# EAGLE design OTEStamper (EAGLE 9.6.2)
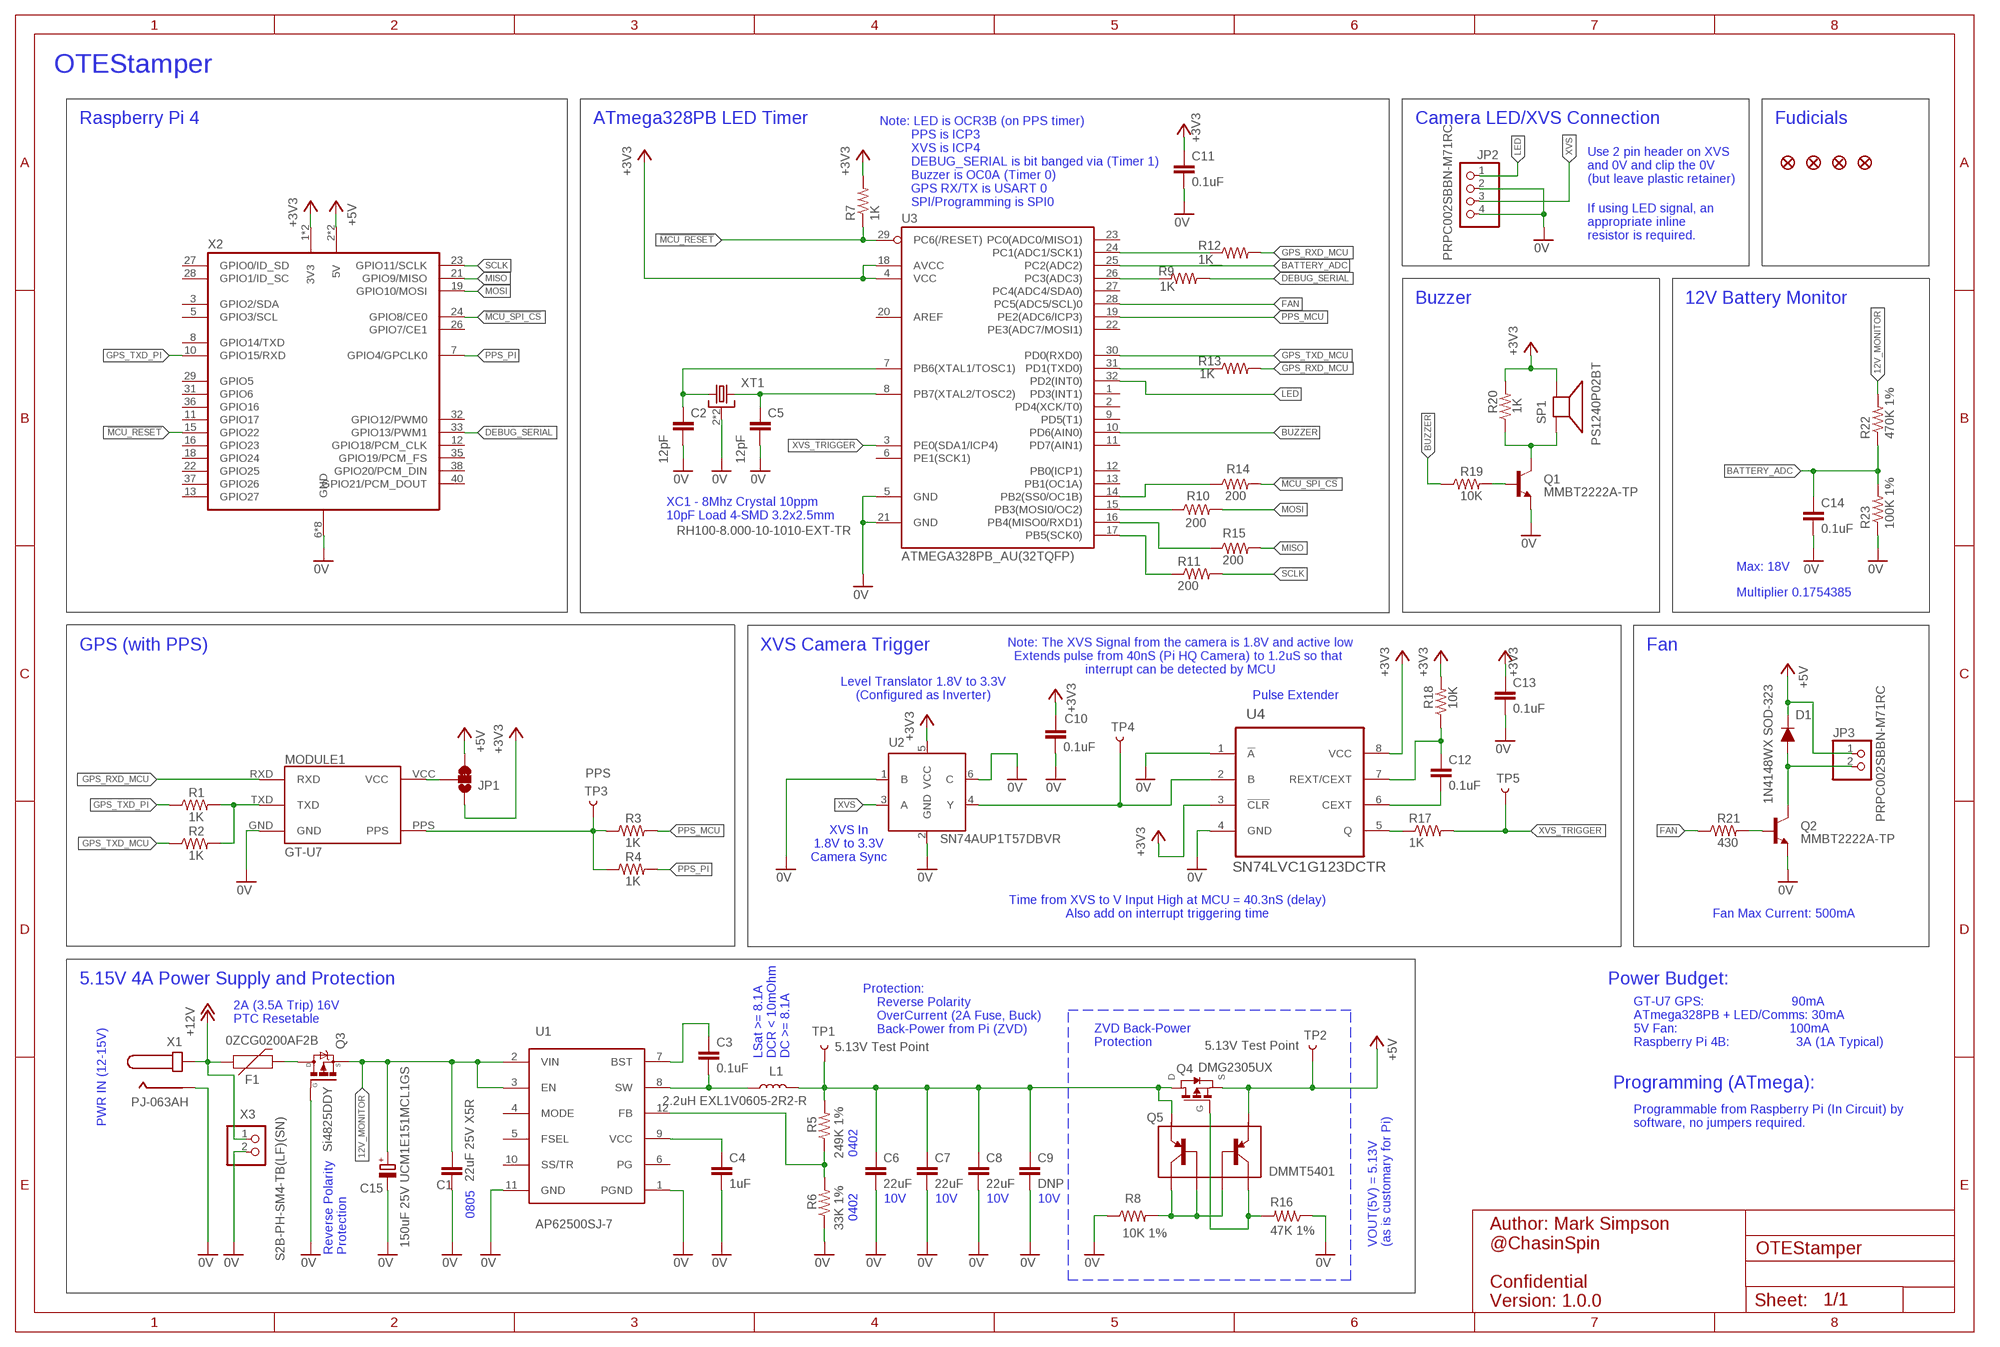
[diagram p0: schematic, sheet 1]

## Parts
C1  22uF 25V X5R  C-EUC0805K  [C0805K]
C2  12pF  C-EU  [C0603K]
C3  0.1uF  C-EUC0402K  [C0402K]
C4  1uF  C-EUC0402K  [C0402K]
C5  12pF  C-EU  [C0603K]
C6  22uF  C-EU  [C0603K]
C7  22uF  C-EU  [C0603K]
C8  22uF  C-EU  [C0603K]
C9  DNP  C-EU  [C0603K]
C10  0.1uF  C-EU  [C0603K]
C11  0.1uF  C-EU  [C0603K]
C12  0.1uF  C-EU  [C0603K]
C13  0.1uF  C-EU  [C0603K]
C14  0.1uF  C-EU  [C0603K]
C15  150uF 25V UCM1E151MCL1GS  CPOL-EUUD-6,3X7,7  [UD-6,3X7,7_NICHICON]
D1  1N4148WX SOD-323  DIODE  [SOD-323]
F1  0ZCG0200AF2B  FUSE-PTCF1812  [F1812]
FD1  FIDUCIALUFIDUCIAL  [FIDUCIAL-MICRO]
FD2  FIDUCIALUFIDUCIAL  [FIDUCIAL-MICRO]
FD3  FIDUCIALUFIDUCIAL  [FIDUCIAL-MICRO]
FD4  FIDUCIALUFIDUCIAL  [FIDUCIAL-MICRO]
JP1  JUMPER-SMT_3_1-NC_TRACE_SILK  [SMT-JUMPER_3_1-NC_TRACE_SILK]
JP2  PRPC002SBBN-M71RC  PINHD-1X4  [1X04]
JP3  PRPC002SBBN-M71RC  PINHD-1X2  [1X02]
L1  2.2uH EXL1V0605-2R2-R  EXL1V0605  [EXL1V0605]
MODULE1  GT-U7  [GT-U7]
Q1  MMBT2222A-TP  MMBT3904LT1G  [SOT23-BEC]
Q2  MMBT2222A-TP  MMBT3904LT1G  [SOT23-BEC]
Q3  Si4825DDY  SI4825DDY  [SOIC-8-BAR]
Q4  DMG2305UX  SI2323DDS  [SI2323DDS]
Q5  DMMT5401  [SOT26(SC74R)]
R1  1K  R-US  [R0603]
R2  1K  R-US  [R0603]
R3  1K  R-US  [R0603]
R4  1K  R-US  [R0603]
R5  249K 1%  R-USR0402  [R0402]
R6  33K 1%  R-USR0402  [R0402]
R7  1K  R-US  [R0603]
R8  10K 1%  R-US  [R0603]
R9  1K  R-US  [R0603]
R10  200  R-US  [R0603]
R11  200  R-US  [R0603]
R12  1K  R-US  [R0603]
R13  1K  R-US  [R0603]
R14  200  R-US  [R0603]
R15  200  R-US  [R0603]
R16  47K 1%  R-US  [R0603]
R17  1K  R-US  [R0603]
R18  10K  R-US  [R0603]
R19  10K  R-US  [R0603]
R20  1K  R-US  [R0603]
R21  430  R-US  [R0603]
R22  470K 1%  R-US  [R0603]
R23  100K 1%  R-US  [R0603]
SP1  PS1240P02BT  PS12/PS12  [PS12]
TP1  5.13V Test Point  TEST-POINT3  [PAD.03X.03]
TP2  5.13V Test Point  TEST-POINT3  [PAD.03X.03]
TP3  PPS  TEST-POINT3  [PAD.03X.03]
TP4  TEST-POINT3  [PAD.03X.03]
TP5  TEST-POINT3  [PAD.03X.03]
U1  AP62500SJ-7  AP62500  [AP62500]
U2  SN74AUP1T57DBVR  SN74AUP1T57  [SOT23-6-DBV]
U3  ATMEGA328PB_AU(32TQFP)  ATMEGA328PB_TQFP  [TQFP32-08]
U4  SN74LVC1G123DCTR  SN74LVC1G123DCT  [SSOP-8-DCT]
X1  PJ-063AH  [PJ-063AH]
X2  ADAFRUIT_2222  RASPBERRY_PI_HAT  [RASPBERRY_PI_HAT]
X3  S2B-PH-SM4-TB(LF)(SN)  [JST-PH-2-SMT-RA]
XT1  RH100-8.000-10-1010-EXT-TR  ECS-ECX-32  [ECS-ECX-32]

## Nets
0V: C1.2 C2.2 C4.2 C5.2 C6.2 C7.2 C8.2 C9.2 C10.2 C11.2 C13.2 C14.2 C15.- JP2.2 JP2.4 MODULE1.GND Q1.E Q2.E Q3.4(G) R6.1 R8.1 R16.1 R23.1 U1.1(PGND) U1.11(GND) U2.1(B) U2.2(GND) U2.6(C) U3.5(GND) U3.21(GND) U4.1(!A) U4.4(GND) X1.2(NEG) X1.SHIELD1(NEG) X1.SHIELD2(NEG) X2.6(GND) X2.9(GND) X2.14(GND) X2.20(GND) X2.25(GND) X2.30(GND) X2.34(GND) X2.39(GND) X3.2 XT1.2 XT1.4
12V_MONITOR: C1.1 C15.+ Q3.1(S) Q3.2(S) Q3.3(S) R22.2 U1.2(VIN) U1.3(EN)
!MCU_RESET: R7.1 U3.29(PC6(/RESET)) X2.15(GPIO22)
!MCU_SPI_CS: R14.2 X2.24(GPIO8/CE0)
+3V3: C10.1 C11.1 C13.1 JP1.1 R7.2 R18.2 R20.2 SP1.P$1(+) U2.5(VCC) U3.4(VCC) U3.18(AVCC) U4.3(!CLR) U4.8(VCC) X2.1(3V3) X2.17(3V3)
+5V: D1.CATHODE(K) JP1.3 JP3.1 Q4.2(S) Q5.5(E2) TP2.P$1 X2.2(5V) X2.4(5V)
+12V: F1.1 X1.1(POS) X3.1
BATTERY_ADC: C14.1 R22.1 R23.2 U3.25(PC2(ADC2))
BUCK_SW: C3.2 L1.1 U1.8(SW)
BUCK_VCC: C4.1 U1.9(VCC)
BUCK_VOUT: C6.1 C7.1 C8.1 C9.1 L1.2 Q4.3(D) Q5.6(E1) R5.2 TP1.P$1
BUZZER: R19.1 U3.10(PD6(AIN0))
DEBUG_SERIAL: R9.2 X2.33(GPIO13/PWM1)
FAN: R21.1 U3.28(PC5(ADC5/SCL)0)
FUSE_OUT: F1.2 Q3.5(D) Q3.6(D) Q3.7(D) Q3.8(D)
GPS_RXD_MCU: MODULE1.RXD R12.2 R13.2
GPS_TXD_MCU: R2.1 U3.30(PD0(RXD0))
GPS_TXD_PI: R1.1 X2.10(GPIO15/RXD)
LED: JP2.1 U3.32(PD2(INT0))
MCU_SPI_SELECT1: R14.1 U3.14(PB2(SS0/OC1B))
MISO: R15.2 X2.21(GPIO9/MISO)
MOSI: R10.2 X2.19(GPIO10/MOSI)
N$1: R9.1 U3.26(PC3(ADC3))
N$2: MODULE1.PPS R3.1 R4.1 TP3.P$1
N$3: D1.ANODE(A) JP3.2 Q2.C
N$4: Q2.B R21.2
N$6: C3.1 U1.7(BST)
N$8: R5.1 R6.2 U1.12(FB)
N$9: Q1.B R19.2
N$10: Q1.C R20.1 SP1.P$2(-)
N$11: MODULE1.TXD R1.2 R2.2
N$13: JP1.2 MODULE1.VCC
N$14: R17.1 U4.5(Q)
N$15: TP4.P$1 U2.4(Y) U4.2(B)
N$16: C12.2 U4.6(CEXT)
N$17: C12.1 R18.1 U4.7(REXT/CEXT)
N$20: C2.1 U3.7(PB6(XTAL1/TOSC1)) XT1.1
N$21: C5.1 U3.8(PB7(XTAL2/TOSC2)) XT1.3
N$22: R10.1 U3.15(PB3(MOSI0/OC2))
N$23: R15.1 U3.16(PB4(MISO0/RXD1))
N$24: R11.1 U3.17(PB5(SCK0))
N$25: R13.1 U3.31(PD1(TXD0))
N$27: R12.1 U3.24(PC1(ADC1/SCK1))
N$28: Q5.1(C1) Q5.2(B1) Q5.3(B2) R8.2
N$31: Q4.1(G) Q5.4(C2) R16.2
PPS_MCU: R3.2 U3.19(PE2(ADC6/ICP3))
PPS_PI: R4.2 X2.7(GPIO4/GPCLK0)
SCLK: R11.2 X2.23(GPIO11/SCLK)
XVS: JP2.3 U2.3(A)
XVS_TRIGGER: R17.2 TP5.P$1 U3.3(PE0(SDA1/ICP4))
Unconnected: U1.4(MODE) U1.5(FSEL) U1.6(PG) U1.10(SS/TR) U3.1(PD3(INT1)) U3.2(PD4(XCK/T0)) U3.6(PE1(SCK1)) U3.9(PD5(T1)) U3.11(PD7(AIN1)) U3.12(PB0(ICP1)) U3.13(PB1(OC1A)) U3.20(AREF) U3.22(PE3(ADC7/MOSI1)) U3.23(PC0(ADC0/MISO1)) U3.27(PC4(ADC4/SDA0)) X2.3(GPIO2/SDA) X2.5(GPIO3/SCL) X2.8(GPIO14/TXD) X2.11(GPIO17) X2.12(GPIO18/PCM_CLK) X2.13(GPIO27) X2.16(GPIO23) X2.18(GPIO24) X2.22(GPIO25) X2.26(GPIO7/CE1) X2.27(GPIO0/ID_SD) X2.28(GPIO1/ID_SC) X2.29(GPIO5) X2.31(GPIO6) X2.32(GPIO12/PWM0) X2.35(GPIO19/PCM_FS) X2.36(GPIO16) X2.37(GPIO26) X2.38(GPIO20/PCM_DIN) X2.40(GPIO21/PCM_DOUT)

## Notes on the sheet
- OTEStamper
- Raspberry Pi 4 | ATmega328PB LED Timer | Camera LED/XVS Connection | Fudicials
- Use 2 pin header on XVS
  and 0V and clip the 0V
  (but leave plastic retainer)
- Note: LED is OCR3B (on PPS timer)
           PPS is ICP3
           XVS is ICP4
           DEBUG_SERIAL is bit banged via (Timer 1)
           Buzzer is OC0A (Timer 0)
           GPS RX/TX is USART 0
           SPI/Programming is SPI0
- If using LED signal, an
  appropriate inline 
  resistor is required.
- Buzzer | 12V Battery Monitor
- XC1 - 8Mhz Crystal 10ppm 
  10pF Load 4-SMD 3.2x2.5mm
- Max: 18V
- Multiplier 0.1754385
- GPS (with PPS) | XVS Camera Trigger | Fan
- Note: The XVS Signal from the camera is 1.8V and active low
  Extends pulse from 40nS (Pi HQ Camera) to 1.2uS so that 
  interrupt can be detected by MCU
- Level Translator 1.8V to 3.3V
  (Configured as Inverter)
- Pulse Extender
- XVS In
  1.8V to 3.3V
  Camera Sync
- Time from XVS to V Input High at MCU = 40.3nS (delay)
  Also add on interrupt triggering time
- Fan Max Current: 500mA
- 5.15V 4A Power Supply and Protection | Power Budget:
- 2A (3.5A Trip) 16V
  PTC Resetable
- Protection:
      Reverse Polarity
      OverCurrent (2A Fuse, Buck)
      Back-Power from Pi (ZVD)
- ZVD Back-Power
  Protection
- GT-U7 GPS:                         90mA
  ATmega328PB + LED/Comms: 30mA
  5V Fan:                                100mA
  Raspberry Pi 4B:                   3A (1A Typical)
- LSat >= 8.1A
  DCR < 10mOhm
  DC >= 8.1A
- Programming (ATmega):
- PWR IN (12-15V)
- Programmable from Raspberry Pi (In Circuit) by
  software, no jumpers required.
- 0402
- 0805 | 10V | 10V | 10V | 10V
- 0402
- VOUT(5V) = 5.13V
  (as is customary for Pi)
- Reverse Polarity
  Protection
- Author: Mark Simpson
  @ChasinSpin
  
  Confidential
  Version: 1.0.0

## Library data of the parts
C1-C14 = SkyFall:C-EU: CAPACITOR, European symbol
C15 = rcl:CPOL-EU: POLARIZED CAPACITOR, European symbol; SPICEPREFIX: C
D1 = SkyFall:DIODE
F1 = SkyFall:FUSE-PTC: PTC Resetable Fuse PTC Resetable Fuse (Polyfuse)
FD1-FD4 = SkyFall:FIDUCIAL: Fiducial Alignment Points Point-of-reference for pick-and-place machines and other optical instruments.
JP1 = SkyFall:JUMPER-SMT_3_1-NC_TRACE: Normally closed trace jumper (1 of 2 connections) This jumper has a trace between two pads so it's normally closed (NC). The other connection is normally open (NO). Use a razor knife to open the connection. For best results follow the IPC guidelines for cutting traces: Cutout at least 0.063 mm (0.005 in). Remove all loose material to clean up the cut area. Seal the cut with an approved epoxy. Reapply solder to reclose the connection, or to close the NO connection.
JP2 = pinhead:PINHD-1X4: PIN HEADER
JP3 = pinhead:PINHD-1X2: PIN HEADER
L1 = SkyFall:EXL1V0605: Eaton EXL1V0605 High Current Molded Inductor Eaton EXL1V0605 High Current Molded Inductor(Datasheet)
MODULE1 = SkyFall:GT-U7: GT-U7 Goouuu Tech GT-U7 GPS Module (Datasheet)
Q1 Q2 = SkyFall:MMBT3904LT1G
Q3 = SkyFall:SI4825DDY: Si4825DDY P-Channel 30V (D-S) MOSFET Si4825DDY P-Channel 30V (D-S) MOSFET(Datasheet)
Q4 = SkyFall:SI2323DDS: SI2323DDS P-Channel MOSFET
Q5 = SkyFall:DMMT5401: DMMT5401 Dual PNP Small Signal Matched Transistors DMMT5401 Dual PNP Small Signal Matched Transistors(Datasheet)
R1-R23 = SkyFall:R-US: RESISTOR, US symbol
SP1 = SkyFall:PS12: SPEAKER Source: Buerklin Added PS12 (for part # PS1240 piezo) http://www.ladyada.net/library/pcb/eaglelibrary.html
TP1-TP5 = SkyFall:TEST-POINT: SparkFun Test Points Bare copper test points for troubleshooting or In-Circuit-Testing. These are used by our Production team for verifying production board runs using pogo-pins on test beds. SparkFun Products: SparkFun LSM9DS1 Breakout <https://www.sparkfun.com/products/13284> SparkFun PSOC <https://www.sparkfun.com/products/13714> SparkFun Load Cell Amplifier <https://www.sparkfun.com/products/13879>
U1 = SkyFall:AP62500: AP62500 4.5V to 18V Input, 5A Synchronous Buck Converter AP62500 4.5V to 18V Input, 5A Synchronous Buck ConverterDatasheet)
U2 = SkyFall:SN74AUP1T57: SN74AUP1T57 - Single-Supply Voltage-Level Translator SN74AUP1T57 - Single-Supply Voltage-Level Translator DBV Package (SOT23-6) (Datasheet)
U3 = SkyFall:ATMEGA328PB_TQFP: Popular 328P in QFP Storefront component: ATmega328 - TQFP (COM-13448) Datasheet SparkFun Products SparkFun RedBoard - Programmed with Arduino (DEV-12757) Arduino Pro Mini 328 - 5V/16MHz (DEV-11113) Arduino Pro Mini 328 - 3.3V/8MHz (DEV-11114) SparkFun OpenLog (DEV-13712) SparkFun MicroView - OLED Arduino Module (DEV-12923) SparkFun Digital Sandbox (DEV-12651) SparkFun PicoBoard (WIG-11888) Arduino Fio (DEV-10116) LilyPad Arduino 328 Main Board (DEV-13342) SparkFun RedStick (DEV-13741) LilyPad MP3 (DEV-11013) LilyPad Arduino SimpleSnap (DEV-10941) SparkFun Stepoko (ROB-13899) SparkFun Geiger Counter (SEN-11345) SparkFun EL Sequencer (COM-12781) Arduino Pro 328 - 5V/16MHz (DEV-10915) CryptoCape (DEV-12773) SparkFun IR Thermometer Evaluation Board - MLX90614 (SEN-10740) SparkFun RedBot Mainboard (ROB-12097) Arduino Pro 328 - 3.3V/8MHz (DEV-10914) SparkFun Block for Intel® Edison - Arduino (DEV-13036) SparkFun Simon Says - Surface Mount Soldering Kit (KIT-10935) SparkFun 7-Segment Serial Display - Red (COM-11441) SparkFun 7-Segment Serial Display - White (COM-11629) SparkFun 7-Segment Serial Display - Yellow (COM-11443) SparkFun 7-Segment Serial Display - Kelly Green (COM-11440) SparkFun 7-Segment Serial Display - Blue (COM-11442) SparkFun OpenSegment Serial Display - 20mm (Blue) (COM-11647) SparkFun OpenSegment Serial Display - 20mm (Green) (COM-11646) SparkFun OpenSegment Serial Display - 20mm (White) (COM-11648) SparkFun OpenSegment Serial Display - 20mm (Red) (COM-11644) SparkFun OpenSegment Serial Display - 20mm (Yellow) (COM-11645) SparkFun OpenSegment Shield (DEV-13190); PROD_ID: IC-09069
U4 = SkyFall:SN74LVC1G123DCT: Single Retriggerable Monostable Multivibrator WIth Schmitt-Trigger Inputs Single Retriggerable Monostable Multivibrator WIth Schmitt-Trigger Inputs (Datasheet)
X1 = SkyFall:PJ-063AH: PJ-063AH 8A DC 2.1x5.5mm Power Jack PJ-063AH 8A DC 2.1x5.5mm Power Jack(Datasheet)
X2 = SkyFall:RASPBERRY_PI_HAT: Raspberry Pi 4 Hat Raspberry Pi 4 Hat + Adafruit 2222 (Datasheet)
X3 = SkyFall:S2B-PH-SM4-TB(LF)(SN): S2B-PH-SM4-TB(LF)(SN) JST-PH Right Angled 2Pos 2mm LiPo S2B-PH-SM4-TB(LF)(SN) JST-PH Right Angled 2Pos 2mm LiPo (Datasheet)
XT1 = clarion:ECS-ECX-32: ECS 3.2 x 2.5 x 0.8mm SMD Crystal ECS ECX-32 Series SMD Crystal (Datasheet)

## Board
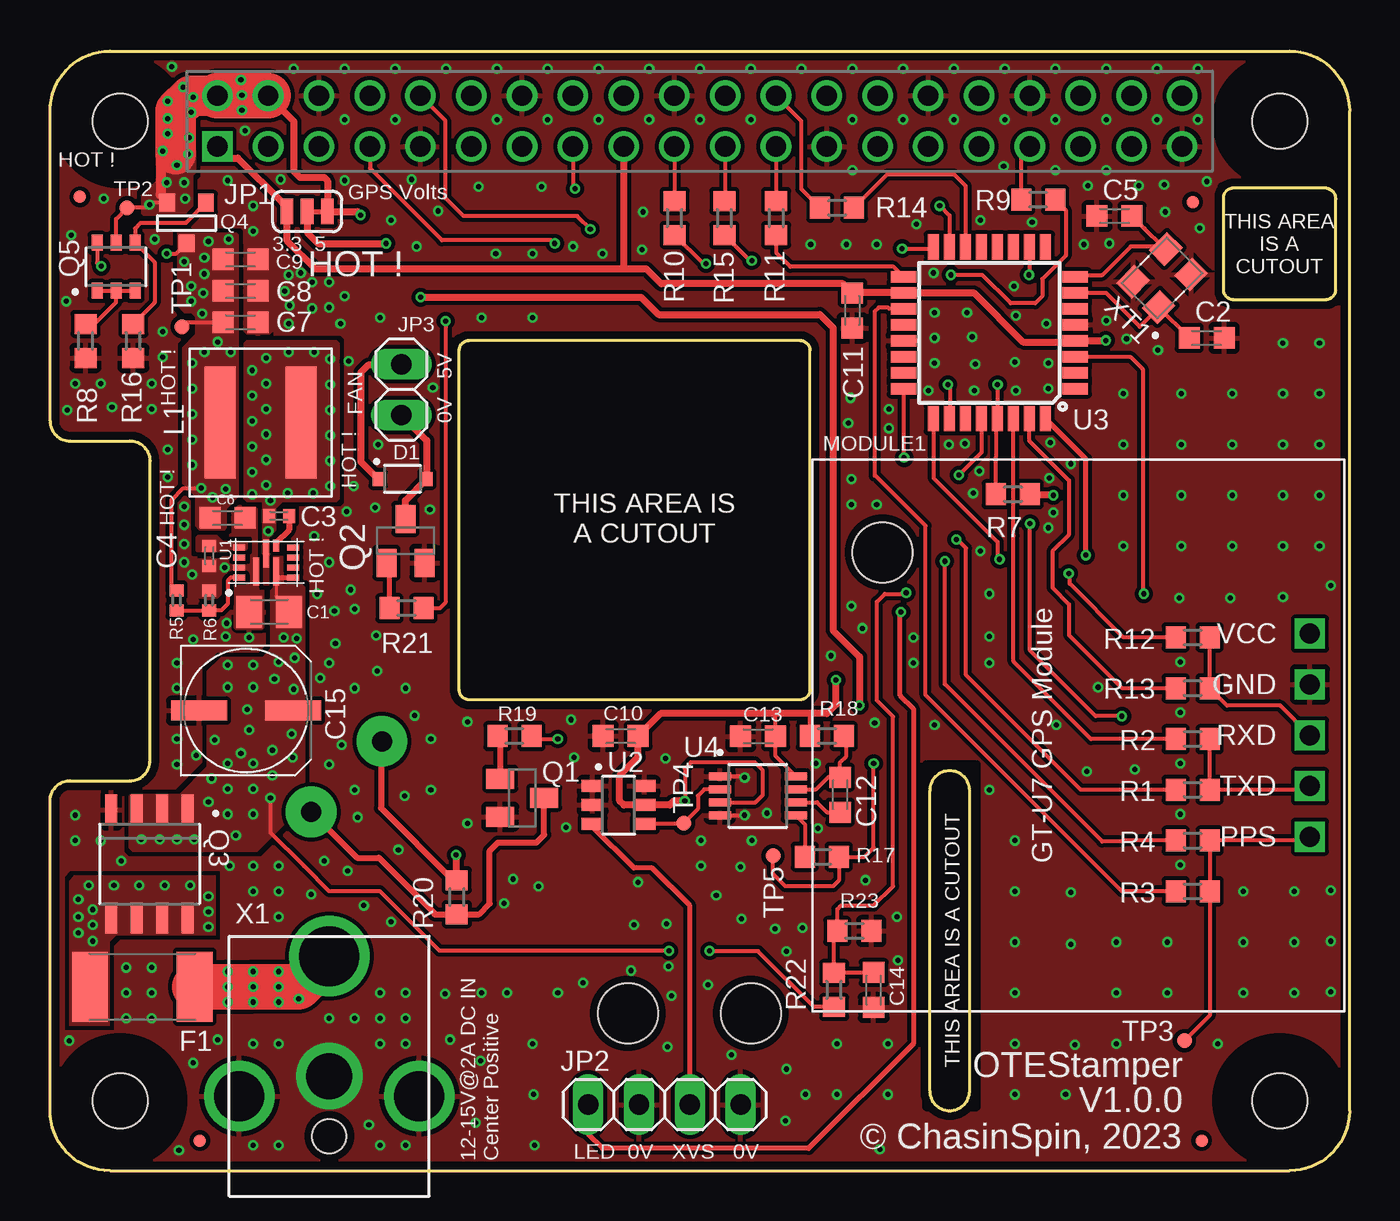
[diagram p1: board, top side]
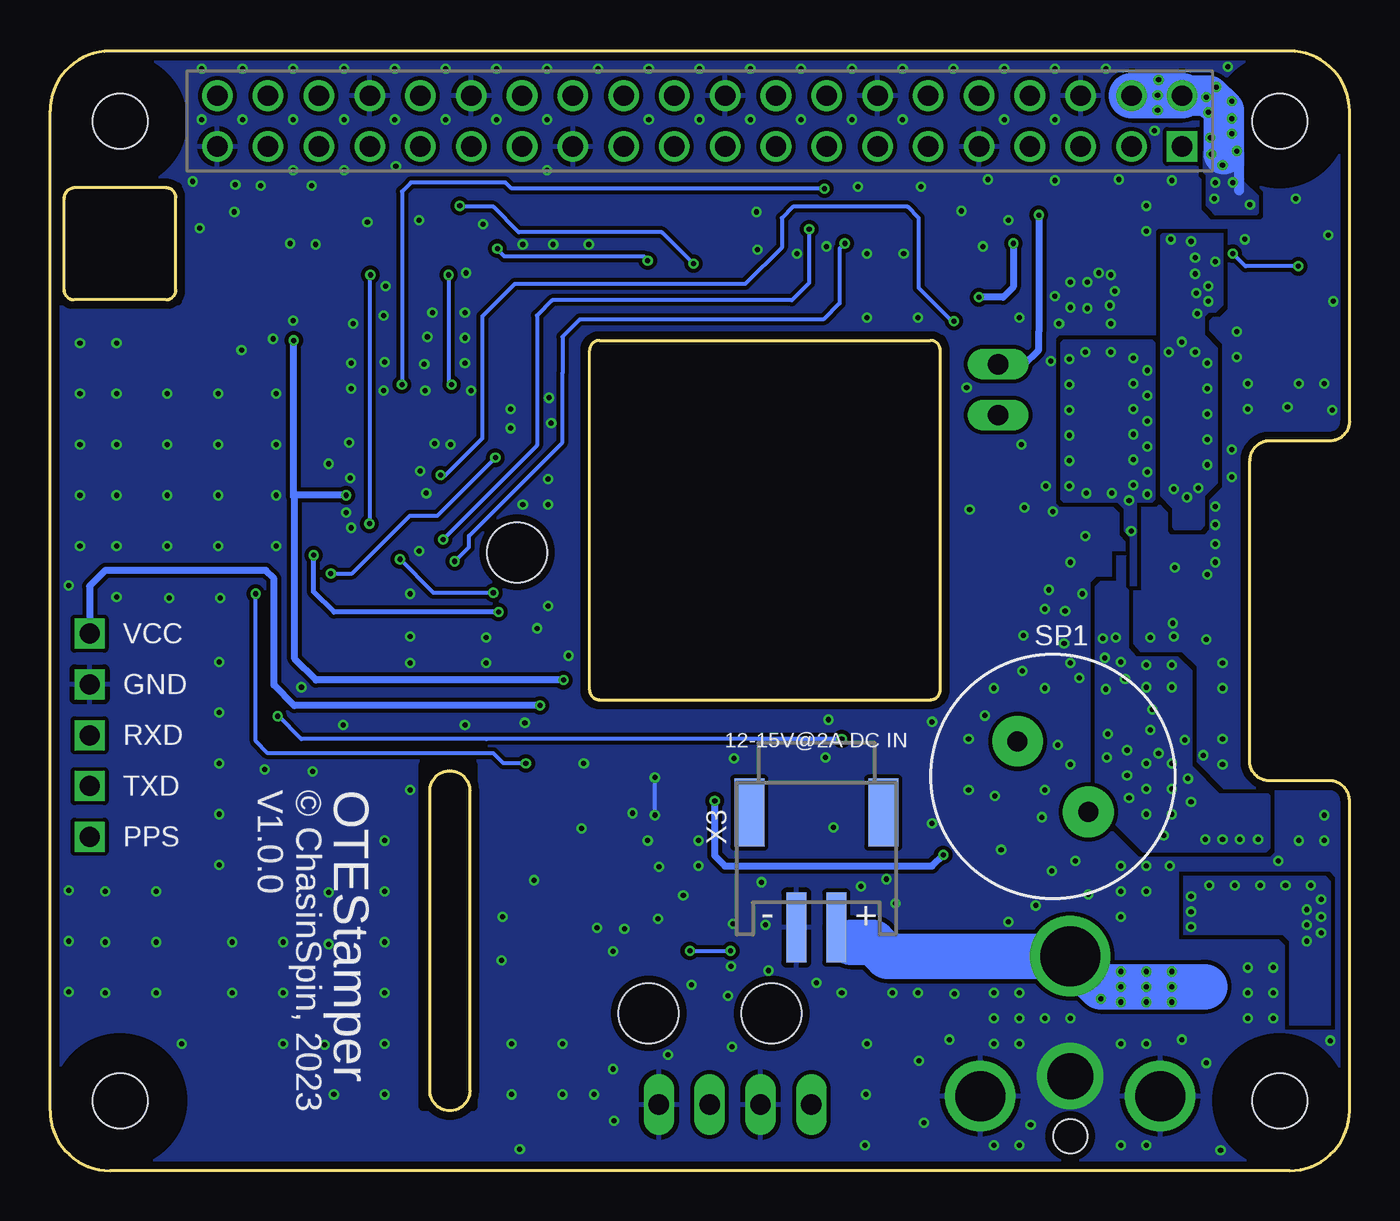
[diagram p2: board, bottom side, seen from below]

Size 65 x 56 mm. Coordinates in mm from the lower left corner, seen from the top.
Outline: 20.47,24.05 20.47,41.03 arc-90 20.97,41.53 37.51,41.53 arc-90 38.01,41.03 38.01,24.05 arc-90 37.51,23.55 20.97,23.55 arc-90 20.47,24.05
Copper layers (1*16): Top 0.035559375mm / dielectric 1.6mm / Bottom 0.035559375mm
Design rules "oshpark-2layer *": minimum track width 6mil, minimum drill 10mil, track to track 6mil, track to pad 6mil, pad to pad 6mil, via to via 6mil, smd to smd 6mil, copper to edge 15mil, drill to drill 6mil, minimum pad ring 5mil, minimum via ring 5mil, stop-mask expansion 2.5mil, vias tented up to drill 20mil, thermal gap 10mil
Holes 3 mm at 28.91,7.87 35.05,7.87
tRestrict: area 20.4,23.5 to 38,41.6; area 58.6,43.5 to 64.4,49.2; area 43.8,3.2 to 46.4,20.3
bRestrict: area 20.4,23.5 to 38,41.6; area 58.6,43.5 to 64.4,49.2; area 43.8,3.2 to 46.4,20.3

### Footprints (pad centres in the part's own frame; a part is rotated, then mirrored left to right if it is on the bottom)
C0805K = smd 1.3 x 1.6: 1 -1,0; 2 1,0
C0603K = smd 1.05 x 1.08: 1 -0.875,0; 2 0.875,0
C0402K = smd 0.6 x 0.7: 1 -0.5,0; 2 0.5,0
UD-6,3X7,7_NICHICON = smd 2.8 x 1: + 2.35,0; - -2.35,0
SOD-323 = smd 0.56 x 0.69: ANODE -1.22,0; CATHODE 1.22,0
F1812 = smd 1.78 x 3.5: 1 -2.615,0; 2 2.615,0
FIDUCIAL-MICRO = smd 0.635 x 0.635: 1 0,0
SMT-JUMPER_3_1-NC_TRACE_SILK = smd 0.635 x 1.27: 1 -1.016,0; 2 0,0; 3 1.016,0
1X04 = drill 1.016 long: 1 -3.81,0; 2 -1.27,0; 3 1.27,0; 4 3.81,0
1X02 = drill 1.016 long: 1 -1.27,0; 2 1.27,0
EXL1V0605 = smd 1.55 x 5.6: 1 -2.025,0; 2 2.025,0
GT-U7 = drill 1 square: GND -2.54,11.58; PPS 5.08,11.58; RXD 0,11.58; TXD 2.54,11.58; VCC -5.08,11.58 | hole 3: -9.15,-9.8
SOT23-BEC = smd 1 x 1.4: B -0.95,-1.1; C 0,1.1; E 0.95,-1.1
SOIC-8-BAR = smd 1.55 x 0.6: 1 -2.7,1.905; 2 -2.7,0.635; 3 -2.7,-0.635; 4 -2.7,-1.905; 5 2.7,-1.905; 6 2.7,-0.635; 7 2.7,0.635; 8 2.7,1.905
SI2323DDS = smd 0.787 x 0.889: 1 0.991,1.016; 2 -0.94,1.016; 3 0.025,-1.016
SOT26(SC74R) = smd 0.8 x 0.55: 1 -1.2,0.95; 2 -1.2,0; 3 -1.2,-0.95; 4 1.2,-0.95; 5 1.2,0; 6 1.2,0.95
R0603 = smd 1 x 1.1: 1 -0.85,0; 2 0.85,0
R0402 = smd 0.6 x 0.7: 1 -0.5,0; 2 0.5,0
PS12 = drill 1 pad 2.54: P$1 -2.5,0; P$2 2.5,0
PAD.03X.03 = smd 0.762 x 0.762: P$1 0,0
AP62500 = smd 1.4 x 0.3: 1 -0.45,0.5; 2 -0.45,-0.5; 8 0.45,0 | smd 0.3 x 0.6: 3 -0.75,-1.35; 4 -0.25,-1.35; 5 0.25,-1.35; 6 0.75,-1.35; 9 0.75,1.35; 10 0.25,1.35; 11 -0.25,1.35; 12 -0.75,1.35 | smd 0.6 x 0.3: 7 0.85,-0.5
SOT23-6-DBV = smd 1.1 x 0.6: 1 -1.3,0.95; 2 -1.3,0; 3 -1.3,-0.95; 4 1.3,-0.95; 5 1.3,0; 6 1.3,0.95
TQFP32-08 = smd 1.27 x 0.559: 1 -4.293,2.8; 2 -4.293,2; 3 -4.293,1.2; 4 -4.293,0.4; 5 -4.293,-0.4; 6 -4.293,-1.2; 7 -4.293,-2; 8 -4.293,-2.8; 17 4.293,-2.8; 18 4.293,-2; 19 4.293,-1.2; 20 4.293,-0.4; 21 4.293,0.4; 22 4.293,1.2; 23 4.293,2; 24 4.293,2.8 | smd 0.559 x 1.27: 9 -2.8,-4.293; 10 -2,-4.293; 11 -1.2,-4.293; 12 -0.4,-4.293; 13 0.4,-4.293; 14 1.2,-4.293; 15 2,-4.293; 16 2.8,-4.293; 25 2.8,4.293; 26 2,4.293; 27 1.2,4.293; 28 0.4,4.293; 29 -0.4,4.293; 30 -1.2,4.293; 31 -2,4.293; 32 -2.8,4.293
SSOP-8-DCT = smd 1.1 x 0.4: 1 -1.9,0.975; 2 -1.9,0.325; 3 -1.9,-0.325; 4 -1.9,-0.975; 5 1.9,-0.975; 6 1.9,-0.325; 7 1.9,0.325; 8 1.9,0.975
PJ-063AH = drill 3: 1 0,12 | drill 2.3: 2 0,6 | drill 2.5: SHIELD1 -4.5,5; SHIELD2 4.5,5 | hole 1.7: 0,3
RASPBERRY_PI_HAT = drill 1.02 square: 1 8.37,51.23 | drill 1.02: 2 8.37,53.77; 3 10.91,51.23; 4 10.91,53.77; 5 13.45,51.23; 6 13.45,53.77; 7 15.99,51.23; 8 15.99,53.77; 9 18.53,51.23; 10 18.53,53.77; 11 21.07,51.23; 12 21.07,53.77; 13 23.61,51.23; 14 23.61,53.77; 15 26.15,51.23; 16 26.15,53.77; 17 28.69,51.23; 18 28.69,53.77; 19 31.23,51.23; 20 31.23,53.77; 21 33.77,51.23; 22 33.77,53.77; 23 36.31,51.23; 24 36.31,53.77; 25 38.85,51.23; 26 38.85,53.77; 27 41.39,51.23; 28 41.39,53.77; 29 43.93,51.23; 30 43.93,53.77; 31 46.47,51.23; 32 46.47,53.77; 33 49.01,51.23; 34 49.01,53.77; 35 51.55,51.23; 36 51.55,53.77; 37 54.09,51.23; 38 54.09,53.77; 39 56.63,51.23; 40 56.63,53.77 | hole 2.75: 3.5,3.5; 61.5,3.5; 61.5,52.5; 3.5,52.5
JST-PH-2-SMT-RA = smd 1 x 3.5: 1 1,-4.35; 2 -1,-4.35 | smd 1.5 x 3.4: NC1 -3.35,1.4; NC2 3.35,1.4
ECS-ECX-32 = smd 1.3 x 1.1: 1 -1.15,-0.9; 2 1.15,-0.9; 3 1.15,0.9; 4 -1.15,0.9

### Placement (x,y rotation side)
C1  10.97,27.95 180 top
C2  57.86,41.66 0 top
C3  11.46,32.75 180 top
C4  7.96,30.75 270 top
C5  53.24,47.75 180 top
C6  8.89,32.65 0 top
C7  9.53,42.43 0 top
C8  9.53,44.01 0 top
C9  9.53,45.58 0 top
C10  28.55,21.74 180 top
C11  40.13,43.03 270 top
C12  39.52,18.8 270 top
C13  35.42,21.73 180 top
C14  41.2,9.04 270 top
C15  9.8,23.01 0 top
D1  17.63,34.59 180 top
F1  4.62,9.19 180 top
FD1  57.16,48.44 0 top
FD2  57.61,1.5 0 top
FD3  1.49,48.71 0 top
FD4  7.49,1.5 0 top
JP1  12.87,47.98 0 top
JP2  30.73,3.3 0 top
JP3  17.58,39.07 270 top
L1  10.53,37.41 180 top
MODULE1  51.44,21.78 270 top
Q1  23.62,18.64 270 top
Q2  17.78,31.5 0 top
Q3  4.98,15.34 270 top
Q4  6.81,47.4 0 top
Q5  3.3,45.21 90 top
R1  57.15,19.05 0 top
R2  57.15,21.59 0 top
R3  57.15,13.97 180 top
R4  57.15,16.51 180 top
R5  6.33,28.52 90 top
R6  7.96,28.52 270 top
R7  48.16,33.83 0 top
R8  1.78,41.5 90 top
R9  49.43,48.56 180 top
R10  31.24,47.65 90 top
R11  36.32,47.65 90 top
R12  57.15,26.67 0 top
R13  57.15,24.13 0 top
R14  39.37,48.16 180 top
R15  33.73,47.65 90 top
R16  4.17,41.5 90 top
R17  38.61,15.7 0 top
R18  38.86,21.74 180 top
R19  23.23,21.74 180 top
R20  20.35,13.68 90 top
R21  17.83,28.14 180 top
R22  39.22,9.04 270 top
R23  40.23,11.99 180 top
SP1  14.83,19.71 315 bottom
TP1  6.6,42.21 90 top
TP2  3.86,48.16 0 top
TP3  56.74,6.5 0 top
TP4  31.7,17.37 0 top
TP5  36.17,15.75 0 top
U1  10.82,30.43 90 top
U2  28.45,18.29 0 top
U3  46.99,41.91 180 top
U4  35.41,18.75 0 top
X1  13.97,-1.27 0 top
X2  0,0 0 top
X3  26.67,16.51 0 bottom
XT1  55.63,44.65 45 top

### Tracks (layer width: path | path; a pad name or v marks a point on that pad's centre or on a via)
0V  (via drill 0.25)
  Top 0.152: 34.69,17.77 34.7,17.78 v34.75,17.78 | U4.1
  Top 0.203: U4.4 34.69,17.77 | v34.75,19.66 34.7,19.71 U4.1
  Bottom 0.203: v34.75,17.78 v34.75,19.66
  other vias: 8.84,27.38 8.74,30.18 7.11,29.82 6.71,30.43 6.71,31.34 6.71,32.31 6.71,33.22 9.96,26.67 8.79,26.72 11.94,42.37 11.99,43.28 11.73,43.99 11.94,44.81 5.23,46.58 14.88,14.99 11.43,13.97 10.16,13.97 11.43,12.7 15.7,13.26 17.07,12.45 16.51,8.89 17.78,8.89 17.78,6.35 17.78,7.62 16.51,7.62 16.51,6.35 15.24,7.62 13.97,7.62 16.51,1.27 11.43,1.27 11.43,6.35 10.16,6.35 5.08,8.89 5.08,10.16 5.08,7.62 3.81,7.62 3.81,10.16 3.81,8.89 0.97,6.5 2.54,16.51 1.27,16.51 1.27,17.78 6.35,20.32 6.35,21.59 17.73,18.75 6.35,24.13 6.35,25.4 7.16,26.57 10.16,15.24 3.56,15.49 8.99,15.24 14.58,21.29 18.24,22.76 19.05,21.59 13.97,25.4 14.27,26.37 14.22,27.99 13.36,28.85 15.24,28.09 13.21,31.75 14.83,32.97 15.19,34.24 16.41,36.32 15.04,29.06 13.97,30.43 14.94,40.49 14.53,42.37 13.97,43.18 13.97,44.45 13.11,43.13 13.11,44.45 12.55,44.91 10.16,46.99 8.89,49.53 10.16,48.26 2.54,39.37 1.27,39.37 0.86,38.05 3.1,38.2 5.08,39.37 5.08,38.1 5.64,40.69 5.64,41.96 1.07,46.79 2.69,48.62 0.81,43.48 5.89,36.07 5.89,34.7 7.16,5.38 8.38,6.55 10.16,1.27 6.45,1.02 17.78,1.27 15.95,2.29 13.06,13.82 11.43,15.24 48.26,13.97 43.18,26.67 43.18,25.4 44.25,22.3 46.18,33.88 44.96,36.32 45.77,36.37 46.48,35 49.99,34.65 50.04,36.42 51.05,35.36 50.19,32.92 49.94,32.16 46.99,28.85 46.99,26.72 46.99,25.4 50.34,22.3 51.87,19.96 54.25,20.07 52.43,24.18 46.53,30.99 40.08,34.59 41.35,33.32 40.08,33.32 40.08,28.24 40.64,27.13 39.07,25.76 41.25,22.4 56.54,25.45 56.54,22.91 56.54,20.37 56.54,17.83 56.54,15.29 56.49,28.65 59.03,28.65 61.67,28.7 56.59,31.24 56.59,33.78 56.59,36.32 56.59,38.86 59.13,38.86 59.13,36.32 59.13,33.78 59.13,31.24 61.67,31.24 61.67,33.78 61.67,36.32 61.67,38.86 63.5,38.86 63.5,36.32 63.5,33.78 63.5,31.24 64.06,29.26 64.06,14.02 53.7,31.24 53.7,33.78 53.7,36.32 53.7,38.86 61.67,41.4 63.5,41.4 57.51,47.14 55.73,49.33 55.78,47.96 57.86,49.48 51.71,46.33 52.98,46.38 52.83,42.52 53.85,41.61 55.42,41.05 51.92,49.28 54.46,49.28 46.53,47.55 49.12,47.45 47.7,50.24 44.2,44.91 44.25,42.93 44.25,41.66 44.25,40.39 43.94,39.01 46.23,39.01 48.31,39.01 49.94,39.12 49.94,40.39 49.83,42.37 48.31,42.77 45.87,42.93 46.13,41.71 46.28,40.34 48.26,40.44 48.21,44.25 41.96,38.1 41.96,37.13 39.93,37.39 40.03,38.66 41.35,46.33 39.83,46.33 38.05,46.33 43.33,47.35 38.3,20.37 38.4,17.12 35.86,17.88 30.78,20.62 48.26,16.51 46.99,19.05 48.26,11.43 51.05,11.33 51.05,13.92 53.34,11.43 55.88,11.43 55.88,8.89 53.34,8.89 48.26,8.89 59.69,8.89 62.23,8.89 62.23,11.43 62.23,13.97 59.69,13.97 59.69,11.43 64.06,11.48 64.06,8.94 48.26,6.35 51.26,6.3 53.34,6.35 58.42,6.35 50.8,3.81 48.26,3.81 41.91,3.81 41.91,6.35 39.37,6.35 39.37,3.81 36.83,5.08 37.8,3.81 34.09,5.79 36.78,2.49 42.37,12.7 42.42,10.52 21.54,5.49 21.29,2.39 20.02,6.55 22.86,8.89 21.59,8.89 22.71,13.36 25.4,8.89 23.16,14.58 24.43,14.22 26.67,9.4 29.06,10.01 29.21,12.29 30.84,12.34 30.94,10.21 36.83,10.97 36.27,12.09 37.64,12.14 40.79,14.53 35.1,16.51 32.56,16.51 32.56,15.24 34.54,15.19 26.06,22.56 26.21,20.68 25.81,17.17 20.88,22.45 20.88,17.37 19.05,19.05 15.24,19.05 15.39,17.68 13.97,20.32 15.24,24.13 17.78,24.13 17.42,16.05 13.51,24.64 13.72,15.49 16.26,33.17 19.15,39.17 19,33.07 21.59,42.67 24.13,42.67 22.3,45.87 24.13,45.87 26.16,46.23 27.64,45.87 29.62,46.08 29.67,47.96 24.59,49.23 21.44,49.23 19.41,48.01 18.34,46.23 17.07,47.55 14.73,49.53 14.73,43.74 11.53,49.58 14.73,52.58 17.27,52.58 22.35,52.58 24.89,52.58 27.43,52.58 29.97,52.58 32.51,52.58 35.05,52.58 40.13,52.58 42.67,52.58 45.21,52.58 47.75,52.58 50.29,52.58 52.83,52.58 55.37,52.58 57.4,52.58 55.37,55.12 57.4,55.12 52.83,55.12 50.29,55.12 47.75,55.12 45.21,55.12 42.67,55.12 40.13,55.12 37.59,55.12 35.05,55.12 32.51,55.12 29.97,55.12 27.43,55.12 24.89,55.12 22.35,55.12 19.81,55.12 17.27,55.12 14.73,55.12 12.19,55.12 6.1,55.22 9.75,52.02 18.08,49.58 40.13,50.04 50.29,50.04 52.83,50.04 16.36,24.99 16.31,26.77 7.32,20.78 16.51,42.67 29.41,14.43 33.32,13.77 34.59,12.6 24.13,6.35 24.18,3.81 24.23,1.27 30.89,6.2 31.09,8.74 32.92,9.3 41.5,1.07 19.76,8.84
  pour Top (isolate 0.203, rank 2): 0,0 0,56 65,56 65,0
  pour Bottom (isolate 0.203, rank 2): 0,0 0,56 65,56 65,0
  pour Top (isolate 0.203, rank 2, no thermals): 10.72,27.18 10.72,29.01 10.46,29.26 10.46,33.02 10.21,33.27 9.35,33.27 9.09,33.02 9.09,31.85 9.25,31.7 9.82,31.7 10.01,31.5 10.01,30.38 9.96,30.33 9.04,30.33 8.79,30.58 7.11,30.58 7.11,28.65 8.38,28.65 8.59,28.85 8.59,29.67 8.94,30.02 9.96,30.02 10.01,29.97 10.01,29.36 9.91,29.26 9.3,29.26 9.19,29.16 9.19,27.18 9.3,27.08 10.62,27.08
  pour Top (isolate 0.203, rank 2, no thermals): 9.7,41.96 9.7,46.38 9.8,46.48 11.02,46.48 11.18,46.33 11.18,42.01 10.97,41.81 9.86,41.81
  pour Top (isolate 0.203, no thermals): 11.68,6.86 11.68,2.79 16.26,2.79 16.26,6.86
  pour Bottom (isolate 0.203, no thermals): 11.68,6.86 11.68,2.79 16.26,2.79 16.26,6.86
12V_MONITOR  (via drill 0.25)
  Top 0.152: 11.32,29.68 U1.2 11.32,28.79 11.39,28.53 C1.1
  Top 0.203: v11.02,18.64 11.02,16.92 12.7,15.24 13.97,13.97 16.51,13.97 19.48,11 v30.96,11 | R22.2 38.2,8.19 35.42,10.97 33.12,10.97 33.07,10.92 v32.99,11
  Top 0.254: 11.32,29.68 U1.3
  Bottom 0.203: v32.99,11 31.01,11 30.99,10.97 v30.96,11
  other vias: 11.68,26.67 8.08,19.61 4.57,16.56 5.49,16.56 6.35,16.56 7.21,16.56 9.3,16.76 7.92,18.44 8.89,17.83 10.16,17.83 10.16,19.1 8.89,19.1 8.89,20.37 10.16,20.37 12.14,20.68 10.16,24.18 8.89,24.18 9.55,20.88 11.43,25.45 12.34,26.62 12.24,25.65 8.89,25.3 10.16,25.3 12.19,24.08 11.13,21.03 11.13,19.76 11.23,24.59 12.09,21.84 9.96,22.05 9.86,23.06 8.23,21.54
  pour Top (isolate 0.203, no thermals): 11.04,26.25 11.04,29.02 11.18,29.16 11.18,30.76 11.19,30.75 11.66,30.75 11.66,29.47 11.82,29.31 12.62,29.31 12.73,29.2 12.73,26.25 12.57,26.09 11.2,26.09
  pour Bottom (isolate 0.203, no thermals): 11.04,26.25 11.04,29.02 11.18,29.16 11.18,30.76 11.19,30.75 11.66,30.75 11.66,29.47 12.46,29.47 12.73,29.2 12.73,26.25 12.57,26.09 11.2,26.09
  pour Top (isolate 0.203, no thermals): 6.5,18.85 7.87,20.22 7.87,24.99 8.59,25.7 10.67,25.7 11.04,26.11 11.04,27.43 12.73,27.43 12.73,18.34 10.33,15.95 4.17,15.95 3.96,16.15 3.96,18.75 4.06,18.85
  pour Bottom (isolate 0.203, no thermals): 6.5,18.85 7.87,20.22 7.87,24.99 8.59,25.7 10.67,25.7 11.04,26.11 11.04,27.43 12.73,27.43 12.73,18.34 10.33,15.95 4.17,15.95 3.96,16.15 3.96,18.75 4.06,18.85
!MCU_RESET  (via drill 0.25)
  Top 0.203: X2.15 26.15,49.24 v26.26,49.12 | v47.4,39.32 U3.29 47.35,37.57 R7.1
  Bottom 0.203: v26.26,49.12 41.91,49.12 42.22,49.43 46.94,49.43 47.4,48.97 v47.4,39.32
!MCU_SPI_CS
  Top 0.203: X2.24 37.57,52.51 37.57,49.11 R14.2
+3V3  (via drill 0.25)
  Top 0.203: U4.3 35.29,18.42 35.66,18.8 35.66,20.02 35.26,20.42 32.05,20.42 31.75,20.12 v31.75,18.49 | 36.32,22.86 36.3,22.83 C13.1 36.3,20.73 U4.8 | R18.2 38.01,22.77 38.1,22.86
  Top 0.305: C11.1 | 51.23,41.45 U3.4 | SP1.P$1 16.56,21.44 16.56,18.14 20.17,14.53 R20.2
  Top 0.356: C11.1 U3.18 46.21,43.91 48.67,41.45 51.23,41.45 | X2.1 8.95,50.65 9.4,50.65 11.61,48.44 11.85,48.2 JP1.1 11.85,46.52 13.26,45.11 28.75,45.11 | 28.75,45.11 29.82,45.11 30.57,44.36 39.67,44.36 C11.1 | X2.17 28.69,45.17 28.75,45.11 | U3.4 52.77,41.51 52.78,41.5 v52.81,41.53 | v50.19,33.78 49.06,33.78 R7.2 | R20.2 20.34,15.67 20.37,15.7 20.37,15.75 v20.32,15.8 | v31.75,18.49 31.19,18.49 30.99,18.29 U2.5 28.7,18.29 28.5,18.49 28.5,19.76 29.43,20.69 C10.1 30.54,22.86 36.32,22.86 38.1,22.86 38.86,22.86 39.32,23.32 v39.32,24.54
  Bottom 0.356: v20.32,15.8 20.88,15.24 31.24,15.24 31.75,15.75 v31.75,18.49 | 52.76,33.73 52.76,25.6 51.69,24.54 v39.32,24.54 | v52.81,41.53 52.81,33.68 52.76,33.73 | 52.76,33.73 52.7,33.78 v50.19,33.78
+5V  (via drill 0.25)
  Top 0.203: Q5.5 3.3,47.6 TP2.P$1 4.93,48.16 5.18,48.41 Q4.2 | 7.03,53.77 v5.89,52.63 | v6.66,54.2 5.94,53.49 v5.89,53.49 6.17,53.77 7.03,53.77 | 7.03,53.77 v5.89,52.63 | v5.89,52.63 6.3,53.03 6.3,52.32 v6.96,51.66 | v5.89,52.63 v5.89,51.87 | X2.2 10.16,53.77 | X2.4 10.88,53.8 | 10.88,53.8 v9.6,53.8 10.88,53.8 | X2.4 10.16,53.77 | X2.4 10.16,53.77 | X2.4 10.18,53.03 v9.6,53.03 | X2.4 10.88,53.8 | X2.4 10.16,53.77 | 10.16,53.77 9.55,54.38 v9.55,54.56 | 7.03,53.77 7.06,53.74 7.06,53.34 | 7.06,53.34 v7.06,52.93 | 6.3,50.85 6.3,50.34 v6.35,50.29 | X2.2 7.49,53.77 7.06,53.34 | X2.2 7.09,53.77 | 7.09,53.77 v6.66,54.2 | X2.2 7.24,53.77 v7.16,53.7 | X2.2 7.09,53.77 | 7.09,53.77 v6.66,54.2
  Top 0.356: X2.4 12.19,52.49 12.19,49.99 12.5,49.68 13.72,49.68 13.88,49.52 JP1.3 15.37,47.98 v15.54,47.8 | JP3.1 17.53,40.28 15.9,40.28 15.54,39.93 15.54,35.46 D1.CATHODE
  Top 0.508: 5.54,51 5.54,48.82
  Top 2.032: X2.2 7.03,53.77 6.3,53.03 6.3,50.85
  Top 2.286: X2.4 10.16,53.77 X2.2
  Bottom 0.356: v15.54,47.8 15.54,41.96 15.54,41.05 15.6,41 16.26,40.34 JP3.1
  Bottom 0.508: 5.54,51.21 5.54,49.02
  Bottom 2.032: X2.2 7.03,53.77 6.3,53.03 6.3,50.85
  Bottom 2.286: X2.4 X2.2 X2.4
  other vias: 6.76,48.62 4.98,48.31 5.84,49.43 6.71,49.43 6.91,50.85 5.64,51
  pour Top (isolate 0.203, no thermals): 4.72,47.8 6.71,47.8 6.96,48.06 7.16,48.26 7.16,49.78 7.32,49.94 7.32,51 5.33,51 5.28,50.95 5.28,49.58 5.33,49.53 4.57,48.77 4.57,48.67 4.57,47.9 4.67,47.8
  pour Bottom (isolate 0.203, no thermals): 4.72,47.8 6.71,47.8 6.96,48.06 7.16,48.26 7.16,49.78 7.32,49.94 7.32,51 5.33,51 5.28,50.95 5.28,49.58 5.33,49.53 4.57,48.77 4.57,48.67 4.57,47.9 4.67,47.8
+12V  (via drill 0.25)
  Top 0.203: v8.89,9.96 v8.89,9.2 v8.89,8.43 | v10.16,9.96 v10.16,9.2 v10.16,8.43 | v11.43,9.96 11.67,9.96 12.44,9.2 | v11.43,9.2 v11.43,8.43
  Top 2.286: X1.1 12.44,9.2 v10.16,9.2 v8.89,9.2 F1.1
  Bottom 0.203: v12.45,8.59 12.44,8.6 12.44,9.2 11.67,8.43 v11.43,8.43 | v11.43,9.96 v10.16,9.96 v8.89,9.96
  Bottom 1.016: X3.1 24.94,11.43
  Bottom 1.27: 13.98,10.72 X1.1
  Bottom 2.286: X1.1 12.44,9.2 F1.1 | 13.98,10.72 23.11,10.72 23.82,11.43 24.94,11.43
BATTERY_ADC  (via drill 0.25)
  Top 0.203: C14.1 41.17,9.89 R22.1 39.22,11.82 R23.2 39.38,13.07 39.57,13.26 41.2,13.26 42.16,14.22 42.16,22.71 41.35,23.52 41.35,28.45 41.76,28.85 42.82,28.85 v42.82,28.91 | v47.5,30.58 47.4,30.68 47.4,31.45 44.19,34.65 U3.25
  Bottom 0.203: v42.82,28.91 45.82,28.91 v47.5,30.58
BUCK_SW  (via drill 0.25)
  other vias: 10.82,34.29 10.82,35.56 10.82,36.83 10.82,38.1 10.82,39.37 10.82,40.64 14.02,40.59 14.02,39.32 14.02,38.05 14.02,36.78 14.02,35.51 14.02,34.24 13.16,33.88 11.89,33.88 11.94,40.94 13.21,40.94 10.11,40.03 10.11,38.76 10.11,37.49 10.11,36.22 10.11,34.95 10.92,31.99 11.02,33.53 10.11,33.83
  pour Top (isolate 0.203, no thermals): 10.65,29.27 10.65,33.45 9.87,33.45 9.71,33.6 9.71,41.38 9.87,41.54 14.31,41.54 14.47,41.38 14.47,33.6 14.31,33.45 11.61,33.45 11.3,33.13 11.3,32.02 10.98,31.71 10.98,29.27
  pour Top (isolate 0.203, no thermals): 10.65,29.27 10.65,33.45 9.87,33.45 9.71,33.6 9.71,41.38 9.87,41.54 14.31,41.54 14.47,41.38 14.47,33.6 14.31,33.45 11.61,33.45 11.3,33.13 11.3,32.02 10.98,31.71 10.98,29.27
  pour Bottom (isolate 0.203, no thermals): 10.65,29.27 10.65,33.45 9.87,33.45 9.71,33.6 9.71,41.38 9.87,41.54 14.31,41.54 14.47,41.38 14.47,33.6 14.31,33.45 11.61,33.45 11.3,33.13 11.3,32.02 10.98,31.71 10.98,29.27
BUCK_VCC
  pour Top (isolate 0.203, no thermals): 7.32,30.99 7.32,31.7 7.42,31.8 8.33,31.8 8.64,31.5 9.8,31.5 9.86,31.45 9.86,31.09 9.8,31.04 8.94,31.04 8.84,30.94 7.37,30.94
BUCK_VOUT  (via drill 0.25)
  Top 0.203: R5.2 6.08,29.02 6.08,33.55 6.67,34.14 v7.57,34.14 | C7.1 6.82,42.43 TP1.P$1 | Q5.6 2.35,45.4 2.54,45.21 v2.56,45.24 | v5.84,45.87 6.33,45.87 Q4.3
  Bottom 0.203: v2.56,45.24 5.21,45.24 v5.84,45.87
  other vias: 8.13,33.68 8.79,34.09 9.04,40.94 7.72,40.94 7.62,42.88 7.67,43.89 7.72,44.86 7.11,35.31 7.11,36.58 7.11,37.85 7.11,39.12 7.11,40.39 7.06,43.48 8.38,41.45 8.94,46.58 7.92,46.48 7.72,45.67 7.06,44.25 6.71,45.47
  pour Top (isolate 0.203, no thermals): 7.47,32.05 8.74,32.05 8.84,32.16 8.84,33.12 9.45,33.73 9.45,46.79 9.35,46.89 6.35,46.89 6.35,43.28 6.71,42.93 7.06,42.93 7.26,42.72 7.26,41.81 6.6,41.15 6.6,34.39 7.26,33.73 7.26,32.26
  pour Bottom (isolate 0.203, no thermals): 7.47,32.05 8.74,32.05 8.84,32.16 8.84,33.12 9.45,33.73 9.45,46.79 9.35,46.89 6.35,46.89 6.35,43.28 6.71,42.93 7.06,42.93 7.26,42.72 7.26,41.81 6.6,41.15 6.6,34.39 7.26,33.73 7.26,32.26
BUZZER  (via drill 0.25)
  Top 0.203: U3.10 48.99,44.94 49.02,44.91 49.02,44.86 v48.97,44.81 | v49.02,32.36 49.02,26.01 52.3,22.73 v53.62,22.73 | R19.1 24.23,21.59 v25.4,21.59
  Bottom 0.203: v48.97,44.81 49.02,44.76 v49.02,32.36 | v53.62,22.73 53.59,22.76 52.43,21.59 43.18,21.59 v25.4,21.59
DEBUG_SERIAL
  Top 0.203: R9.2 48.58,50.8 X2.33
FAN  (via drill 0.25)
  Top 0.203: U3.28 46.59,35.92 v45.47,34.8 | R21.1 19.51,28.14 19.81,28.45 19.81,42.47 v19.79,42.49
  Bottom 0.203: v19.79,42.49 19.89,42.49 21.54,44.15 21.54,47.65 22.1,48.21 27.84,48.21 28.4,47.65 28.4,46.18 30.23,44.35 41.76,44.35 43.38,42.72 43.38,36.63 45.26,34.75 45.47,34.75 v45.47,34.8
FUSE_OUT  (via drill 0.25)
  other vias: 1.42,13.56 1.42,12.7 2.13,13.06 1.42,11.89 2.13,12.29 2.13,11.48 7.92,13.72 7.92,12.95 7.92,12.19 1.93,14.27 3.2,14.27 4.47,14.27 5.74,14.27 7.01,14.27
  pour Top (isolate 0.203, no thermals): 3,7.26 3,11.48 3.3,11.79 8.28,11.79 8.28,14.73 1.22,14.73 0.97,14.48 0.97,7.26
  pour Bottom (isolate 0.203, no thermals): 3,7.26 3,11.48 3.3,11.79 8.28,11.79 8.28,14.73 1.22,14.73 0.97,14.48 0.97,7.26
GPS_RXD_MCU
  Top 0.203: MODULE1.RXD 61.53,23.27 58.86,23.27 R13.2 R12.2
GPS_TXD_MCU
  Top 0.203: R2.1 52.07,21.59 48.19,25.47 48.19,31.75 U3.30
GPS_TXD_PI  (via drill 0.25)
  Top 0.203: X2.10 19.76,52.54 19.76,48.67 20.68,47.75 26.36,47.75 v27.03,47.09 | R1.1 51.56,19.05 45.82,24.79 45.82,31.14 45.36,31.6 v45.34,31.57
  Bottom 0.203: v27.03,47.09 27.03,44.4 27.89,43.54 39.88,43.54 40.64,42.77 40.64,36.27 v45.34,31.57
LED  (via drill 0.25)
  Top 0.254: v42.57,27.94 42.52,27.94 42.52,23.77 43.18,23.11 43.18,6.35 37.95,1.12 27.64,1.12 26.92,1.83 JP2.1 | U3.32 51.82,35.59 v51.82,30.79
  Bottom 0.254: v42.57,27.94 50.8,27.94 51.82,28.96 v51.82,30.79
MCU_SPI_SELECT1
  Top 0.203: R14.1 41.9,49.84 45.21,49.84 45.79,49.26 U3.14
MISO
  Top 0.203: X2.21 33.77,48.54 R15.2
MOSI
  Top 0.203: X2.19 31.23,48.51 R10.2
N$1  (via drill 0.25)
  Top 0.203: R9.1 50.8,48.04 50.8,45.77 49.63,44.6 49.63,43.74 49.28,43.38 48.06,43.38 46.63,44.81 v45.06,44.81 | U3.26 45.01,37.64 45.01,39.22 v44.91,39.32
  Bottom 0.203: v45.06,44.81 45.06,39.32 v44.91,39.32
N$2
  Top 0.203: MODULE1.PPS 62.83,16.51 R4.1 R3.1 58,7.76 TP3.P$1
N$3
  Top 0.356: Q2.C 17.78,33.53 D1.ANODE 18.85,36.52 JP3.2
N$4
  Top 0.254: R21.2 16.98,30.25 Q2.B
N$6
  Top 0.305: C3.1 11.96,32.05 11.32,31.42 U1.7
N$8
  Top 0.203: U1.12 9.46,29.67 9.04,29.67 8.89,29.52 8.89,28.35 8.57,28.02 R6.2 R5.1
N$9
  Top 0.305: R19.2 22.52,21.6 Q1.B
N$10
  Top 0.305: Q1.C 24.72,16.8 24.33,16.41 22.4,16.41 22,16 22,13.36 21.46,12.83 R20.1 19.22,12.83 19.22,12.89 16.46,15.65 15.36,15.65 SP1.P$2
N$11
  Top 0.203: MODULE1.TXD 62.83,19.05 R1.2 R2.2
N$13  (via drill 0.25)
  Top 0.356: JP1.2 12.87,46.93 13.41,46.38 v16.82,46.38 | v18.54,43.69 29.57,43.69 30.43,42.82 38.51,42.82 39.17,42.16 39.17,27.03 40.49,25.7 v40.49,23.27
  Bottom 0.356: v16.82,46.38 16.82,44.2 17.27,43.74 17.32,43.69 v18.54,43.69 | v40.49,23.27 52.78,23.27 53.8,24.28 53.8,29.62 54.2,30.02 62.23,30.02 63.02,29.24 MODULE1.VCC
N$14
  Top 0.203: U4.5 37.76,17.32 R17.1
N$15
  Top 0.203: U2.4 29.78,17.37 TP4.P$1 32.41,18.09 32.41,18.75 32.73,19.07 U4.2
N$16
  Top 0.203: U4.6 38.37,18.42 38.87,17.92 C12.2
N$17
  Top 0.203: U4.7 38.32,19.07 38.96,19.71 39.48,19.71 C12.1 39.52,20.42 39.83,20.73 39.83,21.63 R18.1
N$20
  Top 0.203: U3.7 52.81,43.91 54.51,42.22 55.45,43.16 XT1.1 C2.1
N$21
  Top 0.203: U3.8 51.38,44.81 52.63,44.81 54.05,46.23 55.68,46.23 XT1.3 55.76,46.1 55.61,46.26 | C5.1 54.74,47.12 | 54.74,47.12 55.61,46.26 | 54.74,47.12 55.61,46.26
N$22  (via drill 0.25)
  Top 0.203: R10.1 32.63,45.41 32.77,45.41 v32.82,45.36 | v44.5,48.26 44.99,47.77 U3.15
  Bottom 0.203: v32.82,45.36 34.39,46.94 41.55,46.94 42.82,48.21 44.45,48.21 v44.5,48.26
N$23  (via drill 0.25)
  Top 0.203: R15.1 35.02,45.52 v35.1,45.52 | v42.62,46.13 44.11,46.13 U3.16
  Bottom 0.203: v35.1,45.52 35.31,45.72 42.27,45.72 42.62,46.08 v42.62,46.13
N$24
  Top 0.203: R11.1 36.32,45.92 37.03,45.22 42.19,45.22 U3.17
N$25
  Top 0.203: R13.1 53.65,24.13 50.97,26.8 50.97,28.33 50.14,29.16 50.14,30.99 50.95,31.8 50.97,34.52 48.99,36.5 U3.31
N$27  (via drill 0.25)
  Top 0.203: U3.24 42.7,35.56 42.72,35.56 v42.72,35.66 | R12.1 53.7,26.67 51,29.36 51,29.82 v50.95,29.87
  Bottom 0.203: v50.95,29.87 49.89,29.87 46.99,32.77 45.62,32.77 v42.72,35.66
N$28
  Top 0.203: R8.2 2.22,42.35 3.3,43.43 Q5.2 | Q5.2 Q5.3 | Q5.1 Q5.2
N$31
  Top 0.203: R16.2 5.23,43.42 5.23,45.43 Q5.4 4.25,47.13 4.52,47.4 6.81,47.4 6.81,47.42 Q4.1
PPS_MCU
  Top 0.203: U3.19 41.98,43.11 41.91,43.18 41.45,43.18 41.25,42.98 41.25,34.75 41.3,34.75 43.79,32.26 43.79,23.79 53.61,13.97 R3.2
PPS_PI  (via drill 0.25)
  Top 0.203: X2.7 16,51.22 16,50.14 19.61,46.53 25.09,46.53 v25.25,46.38 | R4.2 53.7,16.51 53.65,16.46 52.63,16.46 44.76,24.33 v44.76,30.48
  Bottom 0.203: v25.25,46.38 25.5,46.13 25.5,43.38 26.31,42.57 38.51,42.57 39.37,41.71 39.37,39.88 39.37,36.42 44.04,31.75 44.04,31.19 v44.76,30.48
SCLK
  Top 0.203: X2.23 36.31,48.51 R11.2
XVS
  Top 0.254: U2.3 27.15,17.2 29.21,15.14 30.12,15.14 32,13.26 JP2.3
XVS_TRIGGER  (via drill 0.25)
  Top 0.203: U3.3 54.03,40.71 54.66,40.08 54.66,28.91 v54.71,28.85 | TP5.P$1 36.17,14.83 36.78,14.22 39.17,14.22 39.46,14.52 R17.2 40.74,15.7 41.2,16.15 v41.2,20.37
  Bottom 0.203: v41.2,20.37 42.32,20.37 42.82,20.88 54.1,20.88 54.71,21.49 v54.71,28.85

### Text on the board
tNames: HOT ! | GPS Volts | 3.3 5 | THIS AREA / IS A / CUTOUT | HOT ! | HOT ! | FAN | 0V 5V | HOT ! | HOT ! | THIS AREA IS / A CUTOUT | HOT ! | THIS AREA IS A CUTOUT | OTEStamper | V1.0.0 | LED 0V XVS 0V | © ChasinSpin, 2023 | 12-15V@2A DC IN / Center Positive
bNames: 12-15V@2A DC IN | OTEStamper | © ChasinSpin, 2023 / V1.0.0